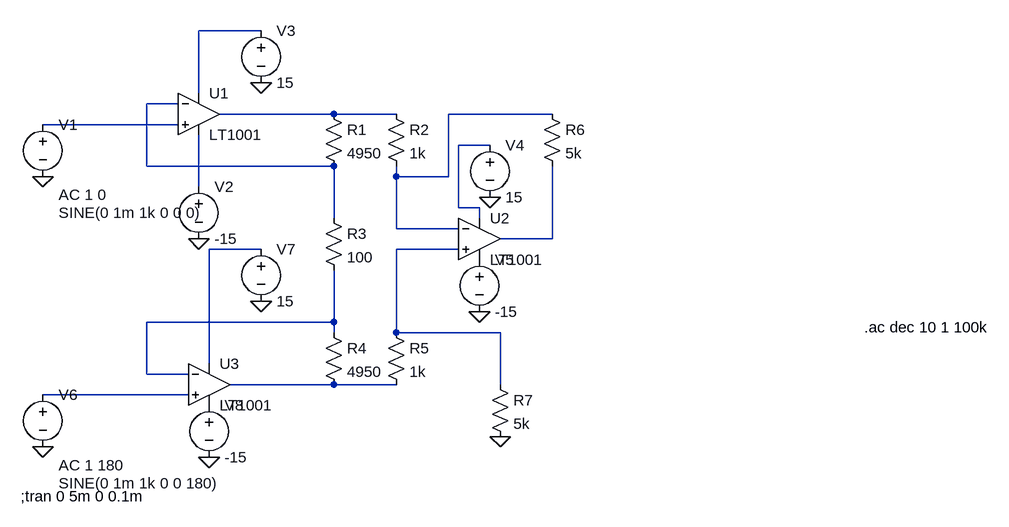
[diagram p0: schematic Draft6.asc]
Draft6.asc, the LTspice schematic file:
Version 4
SHEET 1 1300 720
WIRE 176 -32 80 -32
WIRE 80 64 80 -32
WIRE 48 80 0 80
WIRE 288 96 112 96
WIRE 384 96 288 96
WIRE 624 96 464 96
WIRE 48 112 -160 112
WIRE 528 144 480 144
WIRE 0 176 0 80
WIRE 288 176 0 176
WIRE 384 192 384 176
WIRE 464 192 464 96
WIRE 464 192 384 192
WIRE 80 208 80 128
WIRE 480 240 480 144
WIRE 512 240 480 240
WIRE 288 256 288 176
WIRE 512 256 512 240
WIRE 384 272 384 192
WIRE 480 272 384 272
WIRE 624 288 624 176
WIRE 624 288 544 288
WIRE 176 304 96 304
WIRE 480 304 384 304
WIRE 288 416 288 336
WIRE 288 416 0 416
WIRE 288 432 288 416
WIRE 384 432 384 304
WIRE 544 432 384 432
WIRE 96 480 96 304
WIRE 0 496 0 416
WIRE 64 496 0 496
WIRE 288 512 128 512
WIRE 384 512 288 512
WIRE 544 512 544 432
WIRE 64 528 -160 528
FLAG -160 192 0
FLAG 80 288 0
FLAG 512 400 0
FLAG 544 592 0
FLAG -160 608 0
FLAG 96 624 0
FLAG 176 48 0
FLAG 528 224 0
FLAG 176 384 0
SYMBOL Opamps\\LT1001 80 32 R0
SYMATTR InstName U1
SYMBOL voltage -160 96 R0
WINDOW 3 24 152 Left 2
WINDOW 123 24 124 Left 2
WINDOW 39 0 0 Left 2
SYMATTR Value SINE(0 1m 1k 0 0 0)
SYMATTR Value2 AC 1 0
SYMATTR InstName V1
SYMBOL res 272 80 R0
SYMATTR InstName R1
SYMATTR Value 4950
SYMBOL voltage 80 192 R0
WINDOW 123 0 0 Left 2
WINDOW 39 0 0 Left 2
SYMATTR InstName V2
SYMATTR Value -15
SYMBOL voltage 176 -48 R0
WINDOW 123 0 0 Left 2
WINDOW 39 0 0 Left 2
SYMATTR InstName V3
SYMATTR Value 15
SYMBOL res 368 80 R0
SYMATTR InstName R2
SYMATTR Value 1k
SYMBOL Opamps\\LT1001 512 224 R0
SYMATTR InstName U2
SYMBOL res 272 416 R0
SYMATTR InstName R4
SYMATTR Value 4950
SYMBOL res 272 240 R0
SYMATTR InstName R3
SYMATTR Value 100
SYMBOL res 368 416 R0
SYMATTR InstName R5
SYMATTR Value 1k
SYMBOL res 608 80 R0
SYMATTR InstName R6
SYMATTR Value 5k
SYMBOL voltage 528 128 R0
WINDOW 123 0 0 Left 2
WINDOW 39 0 0 Left 2
SYMATTR InstName V4
SYMATTR Value 15
SYMBOL voltage 512 304 R0
WINDOW 123 0 0 Left 2
WINDOW 39 0 0 Left 2
SYMATTR InstName V5
SYMATTR Value -15
SYMBOL res 528 496 R0
SYMATTR InstName R7
SYMATTR Value 5k
SYMBOL Opamps\\LT1001 96 448 R0
SYMATTR InstName U3
SYMBOL voltage -160 512 R0
WINDOW 3 24 152 Left 2
WINDOW 123 24 124 Left 2
WINDOW 39 0 0 Left 2
SYMATTR Value SINE(0 1m 1k 0 0 180)
SYMATTR Value2 AC 1 180
SYMATTR InstName V6
SYMBOL voltage 176 288 R0
WINDOW 123 0 0 Left 2
WINDOW 39 0 0 Left 2
SYMATTR InstName V7
SYMATTR Value 15
SYMBOL voltage 96 528 R0
WINDOW 123 0 0 Left 2
WINDOW 39 0 0 Left 2
SYMATTR InstName V8
SYMATTR Value -15
TEXT -194 684 Left 2 !;tran 0 5m 0 0.1m
TEXT 1104 424 Left 2 !.ac dec 10 1 100k

The netlist it stands for:
* Draft6.asc
XU1 N005 N002 N001 N007 N003 LT1001  ; pins In+ In- V+ V- OUT
V1 N005 0 SINE(0 1m 1k 0 0 0) AC 1 0
R1 N003 N002 4950
V2 N007 0 -15
V3 N001 0 15
R2 N003 N004 1k
XU2 N010 N004 N006 P001 N008 LT1001  ; pins In+ In- V+ V- OUT
R4 N011 N012 4950
R3 N002 N011 100
R5 N010 N012 1k
R6 N004 N008 5k
V4 N006 0 15
V5 P001 0 -15
R7 N010 0 5k
XU3 N013 N011 N009 P002 N012 LT1001  ; pins In+ In- V+ V- OUT
V6 N013 0 SINE(0 1m 1k 0 0 180) AC 1 180
V7 N009 0 15
V8 P002 0 -15
;tran 0 5m 0 0.1m
.ac dec 10 1 100k
.lib LTC.lib
.backanno
.end